# EAGLE design joulia_controller (EAGLE 8.2.2)
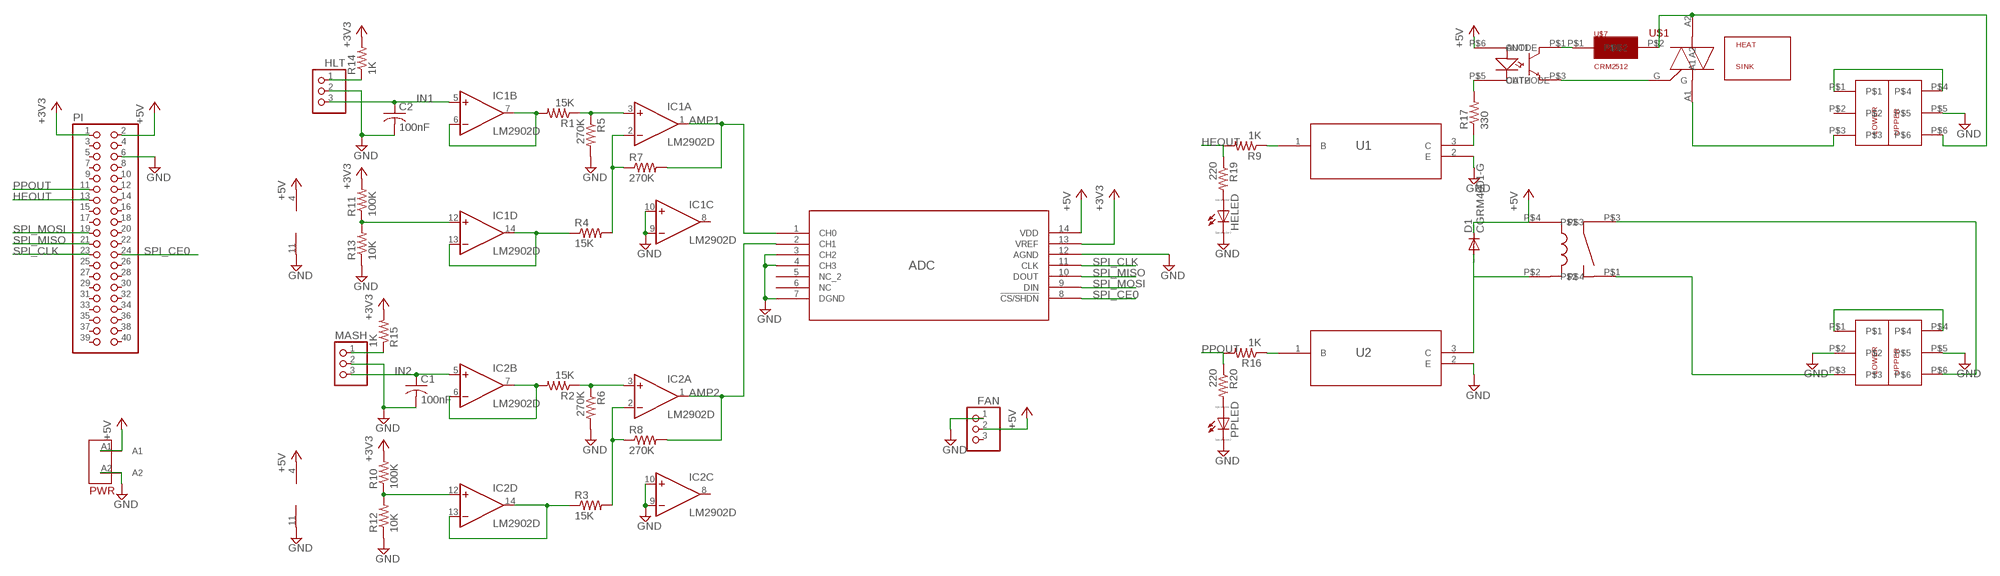
[diagram p0: schematic, sheet 1]

## Parts
ADC  MCP3004-I/SL  [SOIC14-N_MC]
C1  100nF  C-USC0402  [C0402]
C2  100nF  C-USC0402  [C0402]
D1  CGRM4001-G  [SOD-123_MINI-SMA]
FAN  PINHD-1X3  [1X03]
HELED  LED_ESML0603  [LED_SML0603]
HLT  PINHD-1X3  [1X03]
IC1  LM2902D  [SO14]
IC2  LM2902D  [SO14]
MASH  PINHD-1X3  [1X03]
PI  PINHD-2X20  [2X20]
PPLED  LED_ESML0603  [LED_SML0603]
PWR  MTA-100-2HDR2  [HDR2]
R1  15K  R-US_R0402  [R0402]
R2  15K  R-US_R0402  [R0402]
R3  15K  R-US_R0402  [R0402]
R4  15K  R-US_R0402  [R0402]
R5  270K  R-US_R0402  [R0402]
R6  270K  R-US_R0402  [R0402]
R7  270K  R-US_R0402  [R0402]
R8  270K  R-US_R0402  [R0402]
R9  1K  R-US_R0402  [R0402]
R10  100K  R-US_R0402  [R0402]
R11  100K  R-US_R0402  [R0402]
R12  10K  R-US_R0402  [R0402]
R13  10K  R-US_R0402  [R0402]
R14  1K  R-US_R0402  [R0402]
R15  1K  R-US_R0402  [R0402]
R16  1K  R-US_R0402  [R0402]
R17  330  R-US_R1206  [R1206]
R19  220  R-US_R0402  [R0402]
R20  220  R-US_R0402  [R0402]
U1  MMBT2222ALT1G  [SOT-23]
U2  MMBT2222ALT1G  [SOT-23]
U$1  T3050H-6I  [TO-220]
U$2  VM1-038-1AEHORIZONTAL  [VM2-038-1AE]
U$3  G5LE-1A4_DC5  [G5LE-1A4_DC5]
U$4  PC1725041  [PC-MKKDS1.5/3-5.08]
U$5  MOC3020S  [6-SMD]
U$6  PC1719028  [PC-MKKDS5/3-9.5]
U$7  CRM2512  [2512(6432METRIC)]

## Nets
120H [5A_600V]: U$3.P$1 U$4.P$3
120N [5A_600V]: U$4.P$1 U$4.P$4
+3V3: ADC.13(VREF) PI.1 R10.2 R11.2 R14.2 R15.2
+5V: ADC.14(VDD) D1.C FAN.2 IC1.4(P:V+) IC2.4(P:V+) PI.2 PWR.A1 U$3.P$4 U$5.P$6(ANODE)
+120 [30A_600V]: U$6.P$1 U$6.P$4
-120 [30A_600V]: U$1.A1 U$6.P$3
AMP1: ADC.1(CH0) IC1.1(A:OUT) R7.2
AMP2: ADC.2(CH1) IC2.1(A:OUT) R8.2
GND: ADC.3(CH2) ADC.4(CH3) ADC.7(DGND) ADC.12(AGND) C1.2 C2.2 FAN.1 HELED.C HLT.2 IC1.9(C:-IN) IC1.10(C:+IN) IC1.11(P:V-) IC2.9(C:-IN) IC2.10(C:+IN) IC2.11(P:V-) MASH.2 PI.6 PPLED.C PWR.A2 R5.2 R6.2 R12.1 R13.1 U1.2(E) U2.2(E) U$4.P$2 U$4.P$5 U$6.P$5
HEOUT: PI.13 R9.2 R19.1
IN1: C2.1 HLT.3 IC1.5(B:+IN)
IN2: C1.1 IC2.5(B:+IN) MASH.3
N$1: IC1.6(B:-IN) IC1.7(B:OUT) R1.2
N$2: IC1.3(A:+IN) R1.1 R5.1
N$3: IC1.12(D:+IN) R11.1 R13.2
N$4: IC1.2(A:-IN) R4.2 R7.1
N$5: IC1.13(D:-IN) IC1.14(D:OUT) R4.1
N$6: IC2.6(B:-IN) IC2.7(B:OUT) R2.2
N$7: IC2.3(A:+IN) R2.1 R6.1
N$8: IC2.2(A:-IN) R3.2 R8.1
N$9: IC2.12(D:+IN) R10.1 R12.2
N$10: IC2.13(D:-IN) IC2.14(D:OUT) R3.1
N$11: MASH.1 R15.1
N$12: HLT.1 R14.1
N$13: R17.1 U1.3(C)
N$14: R17.2 U$5.P$5(CATHODE)
N$15: R9.1 U1.1(B)
N$16: R16.1 U2.1(B)
N$18: D1.A U2.3(C) U$3.P$2
N$19 [5A_600V]: U$1.G U$5.P$3(OUT2)
N$20 [5A_600V]: U$5.P$1(OUT1) U$7.P$1
N$22 [30A_600V]: U$1.A2 U$6.P$6 U$7.P$2
N$24 [5A_600V]: U$3.P$3 U$4.P$6
N$25: HELED.A R19.2
N$26: PPLED.A R20.2
PPOUT: PI.11 R16.2 R20.1
SPI_CE0: ADC.8(!CS/SHDN) PI.24
SPI_CLK: ADC.11(CLK) PI.23
SPI_MISO: ADC.10(DOUT) PI.21
SPI_MOSI: ADC.9(DIN) PI.19
Unconnected: ADC.5(NC_2) ADC.6(NC) FAN.3 IC1.8(C:OUT) IC2.8(C:OUT) PI.3 PI.4 PI.5 PI.7 PI.8 PI.9 PI.10 PI.12 PI.14 PI.15 PI.16 PI.17 PI.18 PI.20 PI.22 PI.25 PI.26 PI.27 PI.28 PI.29 PI.30 PI.31 PI.32 PI.33 PI.34 PI.35 PI.36 PI.37 PI.38 PI.39 PI.40 U$6.P$2

## Library data of the parts
ADC = digikey:MCP3004-I/SL; MANUFACTURER_PART_NUMBER: MCP3004ISL; VENDOR: Microchip
C1 C2 = resistor:C-US: CAPACITOR, American symbol
D1 = diode:CGRM400*-G: Molded plasitc,JEDEC SOD-123/Mini SMA Source: Comchip CGRM4001-G.pdf
FAN HLT MASH = adafruit:PINHD-1X3: PIN HEADER
HELED PPLED = eagle-ltspice:LED_E: LED Source: http://www.osram.convergy.de Source: www.luxeon.com Source: www.kingbright.com; SPICEMODEL: NONE; SPICEPREFIX: D; SPICETYPE: diode
IC1 IC2 = linear:LM2902: Low power quad operational amplifier Source: Data sgeet <http://www.st.com/internet/com/TECHNICAL_RESOURCES/TECHNICAL_LITERATURE/DATASHEET/CD00000533.pdf>
PI = adafruit:PINHD-2X20: PIN HEADER
PWR = digikey:MTA-100-2
R1-R8 R10 R11 R19 R20 = rcl:R-US_: RESISTOR, American symbol
R9 R12-R17 = resistor:R-US_: RESISTOR, American symbol
U1 U2 = digikey:MMBT2222ALT1G; MANUFACTURER_PART_NUMBER: MMBT2222ALT1G; VENDOR: ON Semiconductor
U$1 = digikey:T3050H-6I
U$2 = digikey:VM1-038-1AE
U$3 = digikey:G5LE-1A4_DC5
U$4 = digikey:PC1725041
U$5 = digikey:MOC3020S
U$6 = digikey:PC1719028
U$7 = digikey:CRM2512

## Net classes
1 5A_600V: width 0.762 mm, clearance 0.508 mm
2 30A_600V: width 7.62 mm, clearance 0.508 mm

## Board
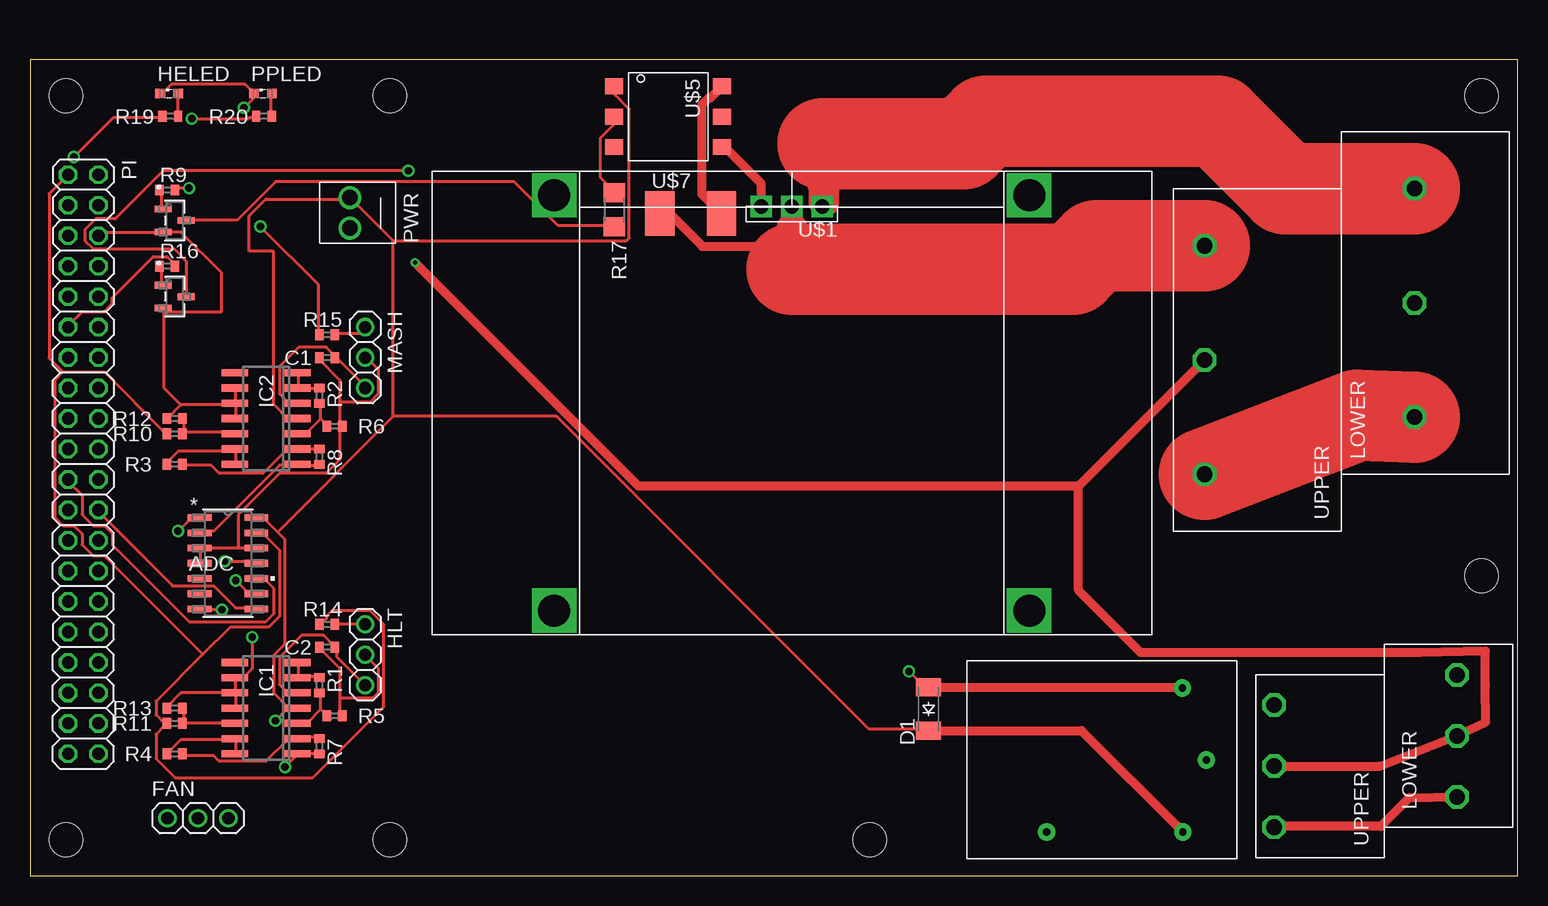
[diagram p1: board, top side]
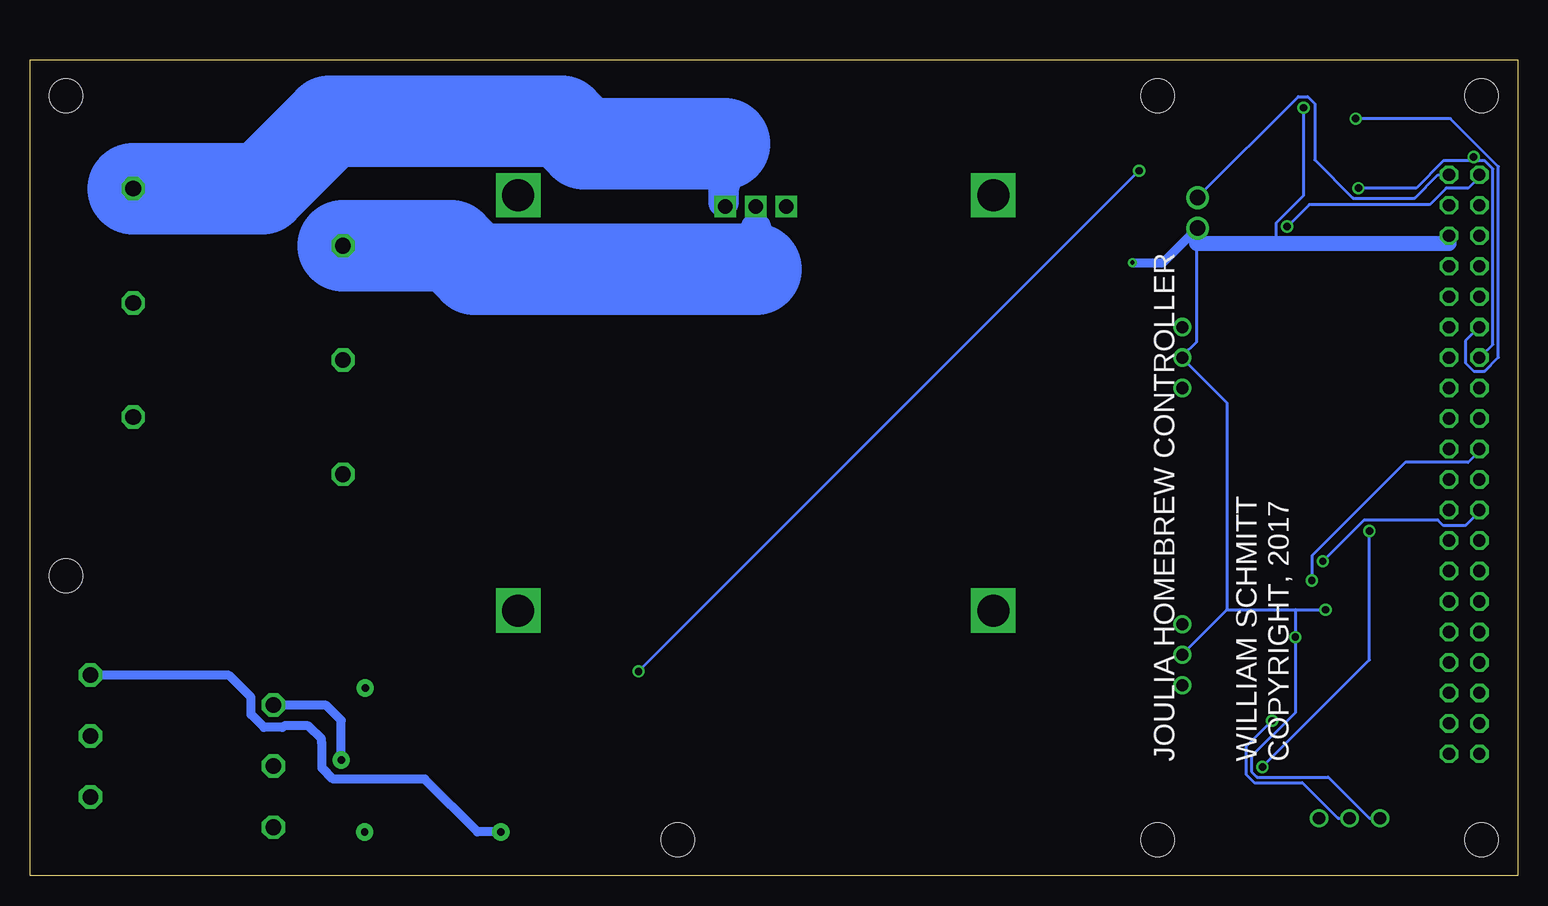
[diagram p2: board, bottom side, seen from below]

Size 124 x 68 mm. Coordinates in mm from the lower left corner, seen from the top.
Outline: 0,0 124,0 124,68 0,68 0,0
Copper layers (1*16): Top 0.035mm / dielectric 1.5mm / Bottom 0.035mm
Design rules "default": minimum track width 10mil, minimum drill 24mil, track to track 8mil, track to pad 8mil, pad to pad 8mil, via to via 8mil, smd to smd 8mil, copper to edge 40mil, drill to drill 8mil, minimum pad ring 10mil, minimum via ring 8mil, stop-mask expansion 4mil, vias tented up to drill 0mil, thermal gap 10mil
Holes 2.8 mm at 3,65 70,3 3,3 121,25 30,65 30,3 121,65

### Footprints (pad centres in the part's own frame; a part is rotated, then mirrored left to right if it is on the bottom)
SOIC14-N_MC = smd 1.981 x 0.559: 1 -2.362,3.81; 2 -2.362,2.54; 3 -2.362,1.27; 4 -2.362,0; 5 -2.362,-1.27; 6 -2.362,-2.54; 7 -2.362,-3.81; 8 2.362,-3.81; 9 2.362,-2.54; 10 2.362,-1.27; 11 2.362,0; 12 2.362,1.27; 13 2.362,2.54; 14 2.362,3.81
C0402 = smd 0.7 x 0.9: 1 -0.65,0; 2 0.65,0
SOD-123_MINI-SMA = smd 1.5 x 2.1: A 1.8,0; C -1.8,0
1X03 = drill 1.016: 1 -2.54,0; 2 0,0; 3 2.54,0
LED_SML0603 = smd 0.8 x 0.8: A 0.75,0; C -0.75,0
SO14 = smd 0.6 x 2.2: 1 -3.81,-2.6; 2 -2.54,-2.6; 3 -1.27,-2.6; 4 0,-2.6; 5 1.27,-2.6; 6 2.54,-2.6; 7 3.81,-2.6; 8 3.81,2.6; 9 2.54,2.6; 10 1.27,2.6; 11 0,2.6; 12 -1.27,2.6; 13 -2.54,2.6; 14 -3.81,2.6
2X20 = drill 1.016 octagon: 1 -24.13,-1.27; 2 -24.13,1.27; 3 -21.59,-1.27; 4 -21.59,1.27; 5 -19.05,-1.27; 6 -19.05,1.27; 7 -16.51,-1.27; 8 -16.51,1.27; 9 -13.97,-1.27; 10 -13.97,1.27; 11 -11.43,-1.27; 12 -11.43,1.27; 13 -8.89,-1.27; 14 -8.89,1.27; 15 -6.35,-1.27; 16 -6.35,1.27; 17 -3.81,-1.27; 18 -3.81,1.27; 19 -1.27,-1.27; 20 -1.27,1.27; 21 1.27,-1.27; 22 1.27,1.27; 23 3.81,-1.27; 24 3.81,1.27; 25 6.35,-1.27; 26 6.35,1.27; 27 8.89,-1.27; 28 8.89,1.27; 29 11.43,-1.27; 30 11.43,1.27; 31 13.97,-1.27; 32 13.97,1.27; 33 16.51,-1.27; 34 16.51,1.27; 35 19.05,-1.27; 36 19.05,1.27; 37 21.59,-1.27; 38 21.59,1.27; 39 24.13,-1.27; 40 24.13,1.27
HDR2 = drill 1.27: A1 0,1.27; A2 0,-1.27
R0402 = smd 0.7 x 0.9: 1 -0.65,0; 2 0.65,0
R1206 = smd 1.6 x 1.803: 1 -1.422,0; 2 1.422,0
SOT-23 = smd 0.559 x 1.422: 1 -0.953,-0.965; 2 0.953,-0.965; 3 0,0.965
TO-220 = drill 1.2 square: A1 -2.54,0; A2 0,0; G 2.54,0
VM2-038-1AE = drill 2.67 square: P$1 10.2,-36.6; P$2 49.8,-36.6; P$3 49.8,-2; P$4 10.2,-2
G5LE-1A4_DC5 = drill 0.6 pad 1.422: P$1 14.25,-15.85; P$2 2.25,-4.55; P$3 8.25,-2.55; P$4 14.25,-4.5
PC-MKKDS1.5/3-5.08 = drill 1.3 octagon: P$1 5.08,4.65; P$2 10.16,4.65; P$3 15.24,4.65; P$4 2.54,19.89; P$5 7.64,19.89; P$6 12.72,19.89
6-SMD = smd 1.3 x 1.5: P$1 -2.54,4.5; P$2 0,4.5; P$3 2.54,4.5; P$4 2.54,-4.5; P$5 0,-4.5; P$6 -2.54,-4.5
PC-MKKDS5/3-9.5 = drill 1.3 octagon: P$1 9.52,7.9; P$2 19.04,7.9; P$3 28.56,7.9; P$4 4.76,25.4; P$5 14.28,25.4; P$6 23.8,25.4
2512(6432METRIC) = smd 2.45 x 3.7: P$1 2.575,0; P$2 -2.575,0

### Placement (x,y rotation side)
ADC  16.51,26.04 0 top
C1  24.77,43.18 180 top
C2  24.77,19.05 180 top
D1  74.9,13.9 90 top
FAN  14,4.8 0 top
HELED  11.6,65.2 0 top
HLT  27.94,18.41 270 top
IC1  19.68,13.97 90 top
IC2  19.68,38.1 90 top
MASH  27.94,43.18 270 top
PI  4.45,34.29 270 top
PPLED  19.4,65.2 0 top
PWR  26.67,55.24 0 top
R1  24.13,15.88 90 top
R2  24.13,40.01 90 top
R3  12.06,34.29 0 top
R4  12.06,10.16 0 top
R5  25.4,13.34 0 top
R6  25.4,37.47 0 top
R7  24.13,10.79 270 top
R8  24.13,34.92 270 top
R9  11.43,57.15 0 top
R10  12.06,36.83 180 top
R11  12.06,12.7 180 top
R12  12.06,38.1 0 top
R13  12.06,13.97 0 top
R14  24.77,20.95 180 top
R15  24.77,45.09 180 top
R16  11.43,50.8 0 top
R17  48.7,55.5 90 top
R19  11.7,63.3 0 top
R20  19.5,63.3 0 top
U1  12.06,54.61 270 top
U2  12.06,48.26 270 top
U$1  63.5,55.77 180 top
U$2  33.5,58.7 0 top
U$3  100.6,17.9 270 top
U$4  123.6,1.5 90 top
U$5  53.2,63.26 270 top
U$6  123.3,28.7 90 top
U$7  55.07,55.2 0 top

### Tracks (layer width: path | path; a pad name or v marks a point on that pad's centre or on a via)
120H
  Bottom 0.762: U$3.P$1 86.69,3.65 91.09,8.05 98.71,8.05 99.65,8.99 99.65,11.05 99.7,11.1 99.7,11.4 100.8,12.5 102.79,12.5 102.94,12.36 104.48,12.36 105.57,13.45 105.57,14.87 107.4,16.7 118.91,16.7 U$4.P$3
120N
  Top 0.762: U$4.P$4 103.6,4.12 112.58,4.12 114.99,6.51 U$4.P$1
+3V3  (via drill 0.61)
  Top 0.254: 14.4,18.44 16.69,20.73 19.89,20.73 20.8,21.64 20.8,27.13 19.43,28.5 18.97,28.5 ADC.13 | 14.4,18.44 10.52,14.55 10.52,13.41 11.2,12.72 R11.2 11.2,12.5 10.52,11.81 10.52,9.75 12.12,8.15 23.55,8.15 29.49,14.1 29.49,20.95 28.35,22.1 25.15,22.1 24.69,21.64 24.69,21.41 24.23,20.95 R14.2 | 2.74,41.99 6.17,41.99 11.2,36.96 R10.2 | 2.74,41.99 1.6,43.13 1.6,56.84 PI.1 | v19.2,54.1 24,49.3 24,45.19 R15.2 | 14.4,18.44 6.17,26.67 5.26,26.67 4.34,27.58 4.34,28.5 3.66,29.18 2.74,29.18 2.06,29.87 2.06,41.3 2.74,41.99
  Bottom 0.254: v19.2,54.1 17.37,55.93 7.32,55.93 5.94,57.3 4.12,57.3 3.2,58.22 PI.1
+5V  (via drill 0.61)
  Top 0.254: IC2.4 21.49,38.1 20.27,39.32 20.27,52.07 18.29,52.07 | 18.29,52.05 18.29,52.07 | 18.29,52.07 18.29,55.02 19.66,56.39 26.52,56.39 PWR.A1 26.75,56.46 30.29,52.92 | PI.2 5.71,58.22 | 30.29,52.92 49.72,52.92 49.95,53.15 49.95,63.89 48.81,65.04 48.81,65.72 U$5.P$6 | 20.63,28.63 21.26,28 21.26,19.32 20.34,18.4 20.34,15.2 21.49,14.06 IC1.4 21.49,13.95 v20.46,12.92 | 20.63,28.63 19.43,29.83 18.97,29.83 ADC.14 | 30.29,38.29 30.29,52.92 | 20.63,28.63 30.29,38.29 | 30.29,38.29 43.89,38.29 69.95,12.23 74.52,12.23 D1.C
  Top 0.762: D1.C 87.65,12.1 U$3.P$4
  Bottom 0.254: PI.2 5.71,58.41 6.63,58.41 8.57,56.46 13.72,56.46 16.92,59.66 16.92,64.35 17.49,64.92 18.29,64.92 26.63,56.58 PWR.A1 | v20.46,12.92 22.63,10.74 22.63,8.46 21.95,7.77 17.95,7.77 14.97,4.8 14.06,4.8 FAN.2
+120
  Top 7.62: U$6.P$4 110.64,38.36 U$6.P$1
-120
  Top 1.016: 66.1,57.49 66.1,55.84 U$1.A1
  Top 2.54: 66.1,60.99 66.1,57.49 66.18,57.41 66.18,56.15
  Top 7.62: U$6.P$3 104.64,57.26 99.03,62.86 79.67,62.86 77.8,60.99 66.1,60.99
  Bottom 2.54: 66.1,60.99 66.1,57.49 66.18,57.41 66.18,56.15
  Bottom 7.62: U$6.P$3 104.64,57.26 99.03,62.86 79.67,62.86 77.8,60.99 66.1,60.99
AMP1  (via drill 0.61)
  Top 0.254: R7.2 24,10.21 22.4,10.21 IC1.1 22.17,9.98 v21.26,9.07 | v12.34,28.73 13.26,29.64 13.95,29.64 ADC.1
  Bottom 0.254: v12.34,28.73 12.34,17.98 v21.26,9.07
AMP2
  Top 0.254: R8.2 24,34.21 22.4,34.21 IC2.1 22.17,34.21 20.8,34.21 15.32,28.73 14.17,28.73 ADC.2
GND  (via drill 0.35, 0.61)
  Top 0.254: PI.6 5.71,53.42 5.94,53.65 10.97,53.65 U1.2 11.2,53.65 12.57,53.65 15.96,50.25 15.96,47.02 11.2,47.02 | 12.57,39.24 11.43,38.1 R12.1 | 12.57,39.24 16.92,39.24 IC2.10 | 11.2,47.02 11.2,40.62 12.57,39.24 | 11.2,47.02 11.2,47.24 U2.2 | IC2.11 17.14,38.1 17.14,39.24 IC2.10 | IC2.9 17.14,40.62 17.14,39.47 IC2.10 | R13.1 11.43,14.1 12.57,15.24 IC1.10 17.14,15.24 | 17.14,15.24 17.14,14.1 IC1.11 | 17.14,15.24 17.14,16.38 IC1.9 17.26,16.34 17.6,16.34 18.52,17.26 v18.52,19.89 | 25.83,14.78 25.83,17.3 24.23,18.9 C2.2 | 25.83,14.78 25.83,13.41 R5.2 | 25.83,14.78 28.57,14.78 29.03,15.24 29.03,17.3 28.12,18.21 HLT.2 | ADC.4 14.17,26.21 14.17,27.13 ADC.3 14.17,27.36 17.37,27.36 | 17.37,27.36 18.75,27.36 ADC.12 | 25.83,39.47 25.83,41.3 24,43.13 C1.2 | 25.83,39.47 25.83,37.64 R6.2 25.83,37.41 25.83,34.67 24.69,33.53 20.8,33.53 17.37,30.1 17.37,27.36 | 25.83,39.47 28.35,39.47 29.03,40.16 29.03,42.22 28.12,43.13 MASH.2 | v16,22.17 14.17,22.17 ADC.7 | HELED.C 10.86,65.27 11.09,65.27 11.77,65.95 17.95,65.95 18.63,65.27 PPLED.C 18.63,65.15 18.63,64.81 v17.83,64.01
  Top 0.762: U$4.P$5 112.53,9.14 U$4.P$2 121.35,12.8 121.31,15.87 121.31,18.71 115.82,18.6 92.6,18.6 87.4,23.8 87.4,32.48 | 87.4,32.48 U$6.P$5 | 87.4,32.48 50.72,32.48 v32.1,51.1
  Bottom 0.254: PWR.A2 26.75,53.87 26.75,52.7 26.75,44.5 27.89,43.36 MASH.2 27.89,43.09 24.23,39.43 24.23,22.17 | PI.6 5.71,53.19 | 24.23,22.17 18.52,22.17 | 18.52,22.17 v16,22.17 | 24.23,22.17 27.89,18.52 HLT.2 | 18.52,22.17 v18.52,19.89 18.52,13.6 22.17,9.94 22.17,8.69 21.72,8.23 15.77,8.23 12.34,4.8 11.54,4.8 FAN.1 | v17.83,64.01 17.83,56.69 20.12,54.41 20.12,52.7
  Bottom 0.762: v32.1,51.1 29.55,51.1 PWR.A2
  Bottom 1.27: PWR.A2 26.75,53.98 26.75,52.7 20.12,52.7 5.71,52.7 PI.6
HEOUT  (via drill 0.61)
  Top 0.254: v13.26,57.3 12.12,57.3 R9.2 | v3.66,59.89 6.97,63.21 10.97,63.21 R19.1
  Bottom 0.254: v13.26,57.3 8.46,57.3 6.17,59.59 3.66,59.59 | 3.66,59.59 2.74,59.59 2.06,58.9 2.06,44.27 2.97,43.36 PI.13 | 3.66,59.59 v3.66,59.89
IN1
  Top 0.254: HLT.3 25.6,18.21 25.6,18.9 C2.1 25.38,19.13 24.46,20.04 22.63,20.04 20.8,18.21 20.8,15.93 21.49,15.24 IC1.5
IN2
  Top 0.254: MASH.3 27.89,40.84 25.6,43.13 C1.1 25.38,43.36 24.69,44.04 22.4,44.04 20.8,42.44 20.8,40.16 21.49,39.47 22.17,39.47 IC2.5
N$1
  Top 0.254: 22.4,16.61 24,16.61 R1.2 | 22.4,16.61 22.4,17.75 IC1.7 | 22.4,16.61 IC1.6
N$2
  Top 0.254: 24.23,13.87 24.23,15.01 R1.1 | 24.23,13.87 24.69,13.41 R5.1 | 24.23,13.87 23.09,12.72 22.4,12.72 IC1.3
N$3
  Top 0.254: 12.8,12.72 12.8,13.87 R13.2 | 12.8,12.72 16.92,12.72 IC1.12 | 12.8,12.72 R11.1
N$4
  Top 0.254: R4.2 12.8,9.98 15.32,9.98 15.77,9.53 19.66,9.53 21.49,11.35 22.17,11.35 IC1.2 22.4,11.58 24,11.58 R7.1
N$5
  Top 0.254: R4.1 11.43,10.21 12.57,11.35 16.92,11.35 IC1.13 17.14,11.35 17.14,10.21 IC1.14
N$6
  Top 0.254: R2.2 24,40.62 22.4,40.62 IC2.6 22.4,40.84 22.4,41.76 IC2.7
N$7
  Top 0.254: 24.23,38.1 24.23,39.24 R2.1 | 24.23,38.1 24.69,37.64 R6.1 | 24.23,38.1 23.09,36.96 22.4,36.96 IC2.3
N$8
  Top 0.254: R3.2 12.8,34.21 15.09,34.21 15.77,33.53 19.43,33.53 21.26,35.36 22.17,35.36 IC2.2 22.4,35.59 24,35.59 R8.1
N$9
  Top 0.254: 12.8,36.96 12.8,38.1 R12.2 | 12.8,36.96 16.92,36.96 IC2.12 | 12.8,36.96 R10.1
N$10
  Top 0.254: R3.1 11.43,34.44 12.34,35.36 16.92,35.36 IC2.13 17.14,35.36 17.14,34.44 IC2.14
N$11
  Top 0.254: R15.1 25.6,45.19 27.43,45.19 27.89,45.64 MASH.1
N$12
  Top 0.254: HLT.1 R14.1
N$13
  Top 0.254: U1.3 13.03,54.63 17.26,54.63 20.46,57.84 40.35,57.84 44.01,54.18 48.69,54.18 R17.1
N$14
  Top 0.254: U$5.P$5 48.69,63.21 48.69,62.64 47.55,61.49 47.55,58.18 48.69,57.04 R17.2
N$15
  Top 0.254: R9.1 10.97,57.07 10.97,55.7 U1.1
N$16
  Top 0.254: R16.1 10.97,50.67 10.97,49.3 U2.1
N$18  (via drill 0.61)
  Top 0.254: U2.3 13.03,51.21 12,52.23 5.26,52.23 4.57,52.92 4.57,53.84 5.49,54.75 7.09,54.75 11.09,58.75 v31.55,58.75 | v73.27,17.03 74.52,15.77 D1.A
  Top 0.762: D1.A 96,15.7 U$3.P$2
  Bottom 0.254: v73.27,17.03 v31.55,58.75
N$19
  Top 0.762: U$5.P$3 57.72,60.69 57.95,60.69 60.92,57.72 U$1.G
N$20
  Top 0.762: U$5.P$1 57.61,65.72 56.69,64.81 56.58,64.81 56.01,64.24 56.01,56.81 57.61,55.21 U$7.P$1
N$22
  Top 0.762: U$7.P$2 53.31,55.2 56.05,52.46 61.6,52.46 63.5,50.56
  Top 1.27: 63.5,50.56 U$1.A2
  Top 2.54: 63.5,50.56 63.5,54
  Top 7.62: U$6.P$6 88.89,52.5 86.93,50.54 79.67,50.54 79.65,50.56 63.5,50.56
  Bottom 2.54: 63.5,50.56 63.5,54
  Bottom 7.62: U$6.P$6 88.89,52.5 86.93,50.54 79.67,50.54 79.65,50.56 63.5,50.56
N$24
  Bottom 0.762: U$3.P$3 98.05,12.95 99.3,14.2 103.69,14.2 U$4.P$6
N$25
  Top 0.254: HELED.A 12.34,65.15 12.34,63.32 R19.2
N$26
  Top 0.254: PPLED.A 20.12,65.15 20.12,63.32 R20.2
PPOUT  (via drill 0.61)
  Top 0.254: R16.2 11.89,50.9 11.89,51.13 11.43,51.59 10.29,51.59 6.86,48.16 6.86,47.7 6.17,47.02 4.34,47.02 3.2,45.87 PI.11 | v13.49,63.09 18.17,63.09 18.29,63.21 18.75,63.21 R20.1
  Bottom 0.254: v13.49,63.09 5.6,63.09 1.6,59.09 1.6,43.2 2.74,42.06 3.66,42.06 4.34,42.75 4.34,44.58 3.2,45.72 PI.11
SPI_CE0
  Top 0.254: ADC.8 18.75,22.33 17.14,22.33 15.32,24.16 11.89,24.16 5.71,30.33 PI.24
SPI_CLK  (via drill 0.61)
  Top 0.254: v16.23,26.21 18.75,26.21 ADC.11
  Bottom 0.254: v16.23,26.21 12.8,29.64 6.63,29.64 6.17,29.18 4.34,29.18 3.2,30.33 PI.23
SPI_MISO
  Top 0.254: ADC.10 18.97,24.61 19.66,24.61 20.34,23.93 20.34,21.87 19.66,21.18 13.26,21.18 6.86,27.58 6.86,28.5 6.17,29.18 5.26,29.18 4.34,30.1 4.34,31.7 3.2,32.84 PI.21
SPI_MOSI  (via drill 0.61)
  Top 0.254: v17.14,24.61 18.06,23.7 18.75,23.7 ADC.9
  Bottom 0.254: v17.14,24.61 17.14,26.67 9.37,34.44 4.12,34.44 3.2,35.36 PI.19

### Text on the board
bNames: WILLIAM SCHMITT / COPYRIGHT, 2017 | JOULIA HOMEBREW CONTROLLER